# Altium project Q24_Steering_Wheel.PrjPcb
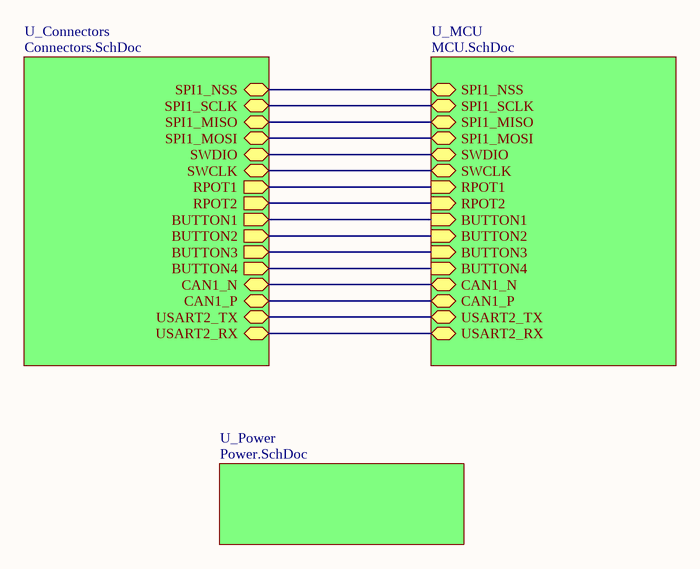
[diagram p0: Top.SchDoc]
5 sheets, 64 parts. Net scope: hierarchical (ports join the sheet entries above them; power ports are global).
Board file: Q24_Steering_Wheel.PcbDoc
Sheets:
  Top.SchDoc
    U_MCU = MCU.SchDoc
      U_CAN = CAN.SchDoc
    U_Connectors = Connectors.SchDoc
    U_Power = Power.SchDoc

## Sheet Top.SchDoc
size A4; SheetNumber: 1; SheetTotal: 5

### Sub-sheets
U_Connectors = Connectors.SchDoc: BUTTON1 (out), BUTTON3 (out), BUTTON4 (out), BUTTON2 (out), USART2_RX (bidir), USART2_TX (bidir), RPOT1 (out), RPOT2 (out), SPI1_MOSI (bidir), SPI1_MISO (bidir), SPI1_SCLK (bidir), SPI1_NSS (bidir), SWDIO (bidir), SWCLK (bidir), CAN1_P (bidir), CAN1_N (bidir)
U_MCU = MCU.SchDoc: USART2_RX (bidir), SPI1_NSS (bidir), SPI1_SCLK (bidir), SPI1_MISO (bidir), SPI1_MOSI (bidir), SWDIO (bidir), SWCLK (bidir), RPOT1 (in), RPOT2 (in), BUTTON3 (in), BUTTON4 (in), BUTTON2 (in), BUTTON1 (in), CAN1_N (bidir), CAN1_P (bidir), USART2_TX (bidir)
U_Power = Power.SchDoc: no entries

### Nets
BUTTON1: sheet U_MCU/BUTTON1, sheet U_Connectors/BUTTON1
BUTTON2: sheet U_MCU/BUTTON2, sheet U_Connectors/BUTTON2
BUTTON3: sheet U_MCU/BUTTON3, sheet U_Connectors/BUTTON3
BUTTON4: sheet U_MCU/BUTTON4, sheet U_Connectors/BUTTON4
CAN1_N: sheet U_MCU/CAN1_N, sheet U_Connectors/CAN1_N
CAN1_P: sheet U_MCU/CAN1_P, sheet U_Connectors/CAN1_P
RPOT1: sheet U_MCU/RPOT1, sheet U_Connectors/RPOT1
RPOT2: sheet U_MCU/RPOT2, sheet U_Connectors/RPOT2
NetIC1_16: sheet U_MCU/USART2_TX, sheet U_Connectors/USART2_TX
NetIC1_17: sheet U_MCU/USART2_RX, sheet U_Connectors/USART2_RX
NetIC1_20: sheet U_MCU/SPI1_NSS, sheet U_Connectors/SPI1_NSS
NetIC1_21: sheet U_MCU/SPI1_SCLK, sheet U_Connectors/SPI1_SCLK
NetIC1_22: sheet U_MCU/SPI1_MISO, sheet U_Connectors/SPI1_MISO
NetIC1_23: sheet U_MCU/SPI1_MOSI, sheet U_Connectors/SPI1_MOSI
NetIC1_46: sheet U_MCU/SWDIO, sheet U_Connectors/SWDIO
NetIC1_49: sheet U_MCU/SWCLK, sheet U_Connectors/SWCLK

## Sheet MCU.SchDoc
size 381 x 241 mm; SheetNumber: 4; SheetTotal: 5
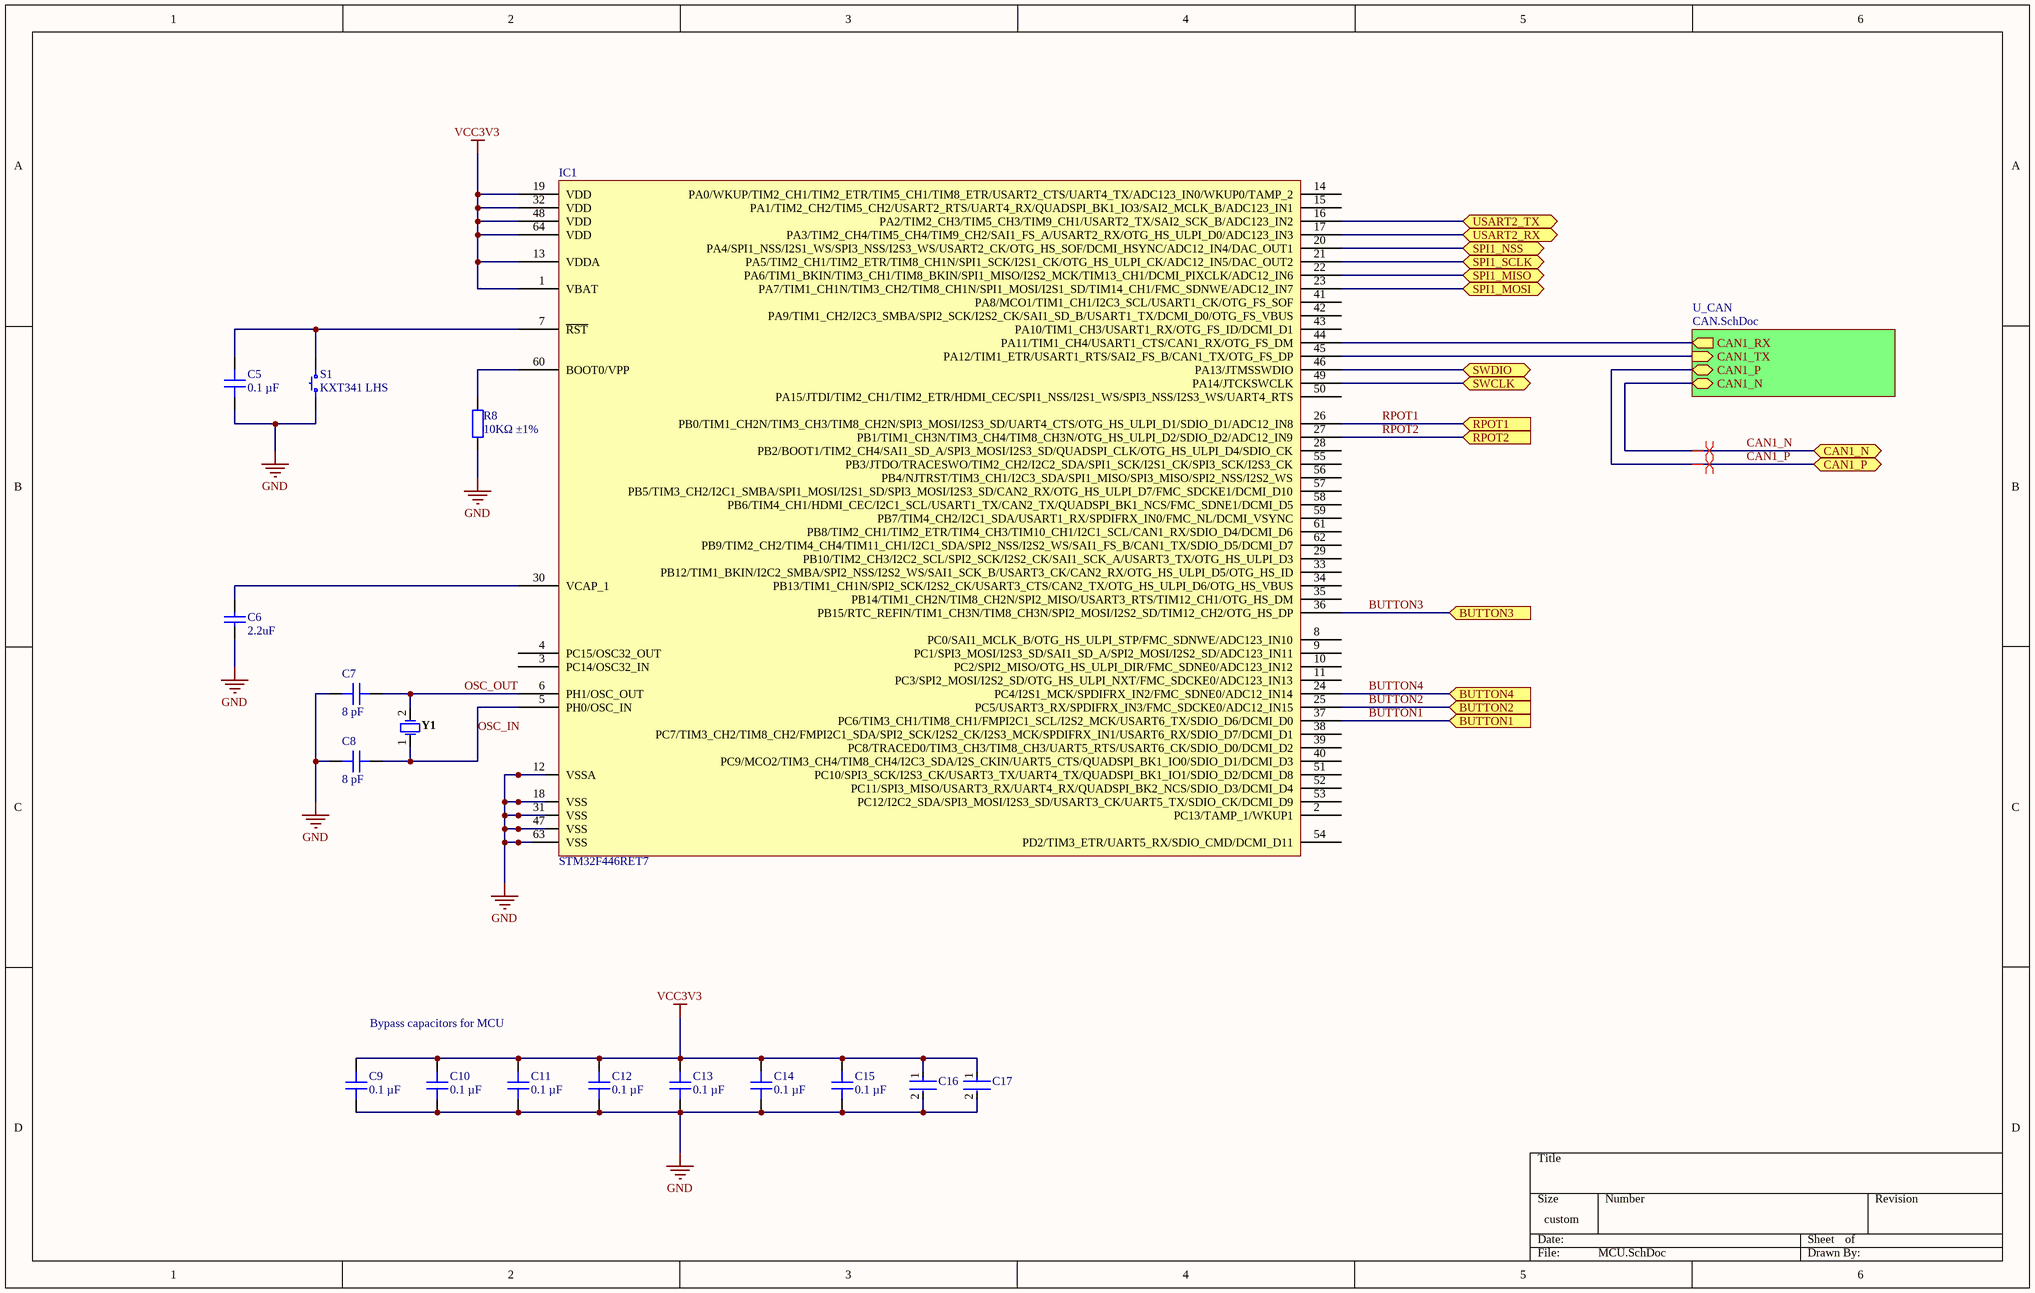
[diagram p1: MCU.SchDoc]

### Parts
C5  0.1 µF  [CAP 0402_1005]
C6  2.2uF  [0603_C]
C7  8 pF  [CAP 0402_1005]
C8  8 pF  [CAP 0402_1005]
C9  0.1 µF  [CAP 0402_1005]
C10  0.1 µF  [CAP 0402_1005]
C11  0.1 µF  [CAP 0402_1005]
C12  0.1 µF  [CAP 0402_1005]
C13  0.1 µF  [CAP 0402_1005]
C14  0.1 µF  [CAP 0402_1005]
C15  0.1 µF  [CAP 0402_1005]
C16  CGB2A1X5R1A105K033BC  [FP-CGB2A-IPC_B]  (value not drawn)
C17  CGB2A1X5R1A105K033BC  [FP-CGB2A-IPC_B]  (value not drawn)
IC1  STM32F446RET7  [ST LQFP-64 10X10MM]
R8  10KΩ ±1%  [0402_R]
S1  KXT341 LHS  [C&K KXT3]
Y1  NX3225GD-8MHZ-STD-CRA-3  [NDK-NX3225GD-8MHZ-STD-CRA-3_V]  (value not drawn)

### Sub-sheets
U_CAN = CAN.SchDoc: CAN1_TX (in), CAN1_RX (out), CAN1_P (bidir), CAN1_N (bidir)

### Ports
BUTTON1 (in, see Top[3B], Connectors[1B]), BUTTON2 (in, see Top[3B], Connectors[2B]), BUTTON3 (in, see Top[3B], Connectors[1C]), BUTTON4 (in, see Top[3B], Connectors[2C]), CAN1_N (bidir, see Top[3B], CAN[3B], Connectors[2D]), CAN1_P (bidir, see Top[3B], CAN[3B], Connectors[2D]), RPOT1 (in, see Top[3B], Connectors[3A]), RPOT2 (in, see Top[3B], Connectors[4A]), SPI1_MISO (bidir, see Top[3B], Connectors[3C]), SPI1_MOSI (bidir, see Top[3B], Connectors[3C]), SPI1_NSS (bidir, see Top[3A], Connectors[3C]), SPI1_SCLK (bidir, see Top[3B], Connectors[3C]), SWCLK (bidir, see Top[3B], Connectors[3B]), SWDIO (bidir, see Top[3B], Connectors[3B]), USART2_RX (bidir, see Top[3B], Connectors[3B]), USART2_TX (bidir, see Top[3B], Connectors[3C])

### Nets
GND: C5.1 C6.1 C7.2 C8.2 C9.1 C10.1 C11.1 C12.1 C13.1 C14.1 C15.1 C16.2 C17.2 IC1.12(VSSA) IC1.18(VSS) IC1.31(VSS) IC1.47(VSS) IC1.63(VSS) R8.1 S1.1
VCC3V3: C9.2 C10.2 C11.2 C12.2 C13.2 C14.2 C15.2 C16.1 C17.1 IC1.1(VBAT) IC1.13(VDDA) IC1.19(VDD) IC1.32(VDD) IC1.48(VDD) IC1.64(VDD)
BUTTON1: IC1.37(PC6/TIM3_CH1/TIM8_CH1/FMPI2C1_SCL/I2S2_MCK/USART6_TX/SDIO_D6/DCMI_D0) ; port BUTTON1
BUTTON2: IC1.25(PC5/USART3_RX/SPDIFRX_IN3/FMC_SDCKE0/ADC12_IN15) ; port BUTTON2
BUTTON3: IC1.36(PB15/RTC_REFIN/TIM1_CH3N/TIM8_CH3N/SPI2_MOSI/I2S2_SD/TIM12_CH2/OTG_HS_DP) ; port BUTTON3
BUTTON4: IC1.24(PC4/I2S1_MCK/SPDIFRX_IN2/FMC_SDNE0/ADC12_IN14) ; port BUTTON4
CAN1_N: port CAN1_N, sheet U_CAN/CAN1_N
CAN1_P: port CAN1_P, sheet U_CAN/CAN1_P
OSC_IN: C8.1 IC1.5(PH0/OSC_IN) Y1.1
OSC_OUT: C7.1 IC1.6(PH1/OSC_OUT) Y1.2
RPOT1: IC1.26(PB0/TIM1_CH2N/TIM3_CH3/TIM8_CH2N/SPI3_MOSI/I2S3_SD/UART4_CTS/OTG_HS_ULPI_D1/SDIO_D1/ADC12_IN8) ; port RPOT1
RPOT2: IC1.27(PB1/TIM1_CH3N/TIM3_CH4/TIM8_CH3N/OTG_HS_ULPI_D2/SDIO_D2/ADC12_IN9) ; port RPOT2
NetC5_2: C5.2 IC1.7(~{RST}) S1.2
NetC6_2: C6.2 IC1.30(VCAP_1)
NetIC1_16: IC1.16(PA2/TIM2_CH3/TIM5_CH3/TIM9_CH1/USART2_TX/SAI2_SCK_B/ADC123_IN2) ; port USART2_TX
NetIC1_17: IC1.17(PA3/TIM2_CH4/TIM5_CH4/TIM9_CH2/SAI1_FS_A/USART2_RX/OTG_HS_ULPI_D0/ADC123_IN3) ; port USART2_RX
NetIC1_20: IC1.20(PA4/SPI1_NSS/I2S1_WS/SPI3_NSS/I2S3_WS/USART2_CK/OTG_HS_SOF/DCMI_HSYNC/ADC12_IN4/DAC_OUT1) ; port SPI1_NSS
NetIC1_21: IC1.21(PA5/TIM2_CH1/TIM2_ETR/TIM8_CH1N/SPI1_SCK/I2S1_CK/OTG_HS_ULPI_CK/ADC12_IN5/DAC_OUT2) ; port SPI1_SCLK
NetIC1_22: IC1.22(PA6/TIM1_BKIN/TIM3_CH1/TIM8_BKIN/SPI1_MISO/I2S2_MCK/TIM13_CH1/DCMI_PIXCLK/ADC12_IN6) ; port SPI1_MISO
NetIC1_23: IC1.23(PA7/TIM1_CH1N/TIM3_CH2/TIM8_CH1N/SPI1_MOSI/I2S1_SD/TIM14_CH1/FMC_SDNWE/ADC12_IN7) ; port SPI1_MOSI
NetIC1_44: IC1.44(PA11/TIM1_CH4/USART1_CTS/CAN1_RX/OTG_FS_DM) ; sheet U_CAN/CAN1_RX
NetIC1_45: IC1.45(PA12/TIM1_ETR/USART1_RTS/SAI2_FS_B/CAN1_TX/OTG_FS_DP) ; sheet U_CAN/CAN1_TX
NetIC1_46: IC1.46(PA13/JTMSSWDIO) ; port SWDIO
NetIC1_49: IC1.49(PA14/JTCKSWCLK) ; port SWCLK
NetIC1_60: IC1.60(BOOT0/VPP) R8.2

Not connected (* = marked no-connect by the designer): IC1 2(PC13/TAMP_1/WKUP1) 3(PC14/OSC32_IN) 4(PC15/OSC32_OUT) 8(PC0/SAI1_MCLK_B/OTG_HS_ULPI_STP/FMC_SDNWE/ADC123_IN10) 9(PC1/SPI3_MOSI/I2S3_SD/SAI1_SD_A/SPI2_MOSI/I2S2_SD/ADC123_IN11) 10(PC2/SPI2_MISO/OTG_HS_ULPI_DIR/FMC_SDNE0/ADC123_IN12) 11(PC3/SPI2_MOSI/I2S2_SD/OTG_HS_ULPI_NXT/FMC_SDCKE0/ADC123_IN13) 14(PA0/WKUP/TIM2_CH1/TIM2_ETR/TIM5_CH1/TIM8_ETR/USART2_CTS/UART4_TX/ADC123_IN0/WKUP0/TAMP_2) 15(PA1/TIM2_CH2/TIM5_CH2/USART2_RTS/UART4_RX/QUADSPI_BK1_IO3/SAI2_MCLK_B/ADC123_IN1) 28(PB2/BOOT1/TIM2_CH4/SAI1_SD_A/SPI3_MOSI/I2S3_SD/QUADSPI_CLK/OTG_HS_ULPI_D4/SDIO_CK) 29(PB10/TIM2_CH3/I2C2_SCL/SPI2_SCK/I2S2_CK/SAI1_SCK_A/USART3_TX/OTG_HS_ULPI_D3) 33(PB12/TIM1_BKIN/I2C2_SMBA/SPI2_NSS/I2S2_WS/SAI1_SCK_B/USART3_CK/CAN2_RX/OTG_HS_ULPI_D5/OTG_HS_ID) 34(PB13/TIM1_CH1N/SPI2_SCK/I2S2_CK/USART3_CTS/CAN2_TX/OTG_HS_ULPI_D6/OTG_HS_VBUS) 35(PB14/TIM1_CH2N/TIM8_CH2N/SPI2_MISO/USART3_RTS/TIM12_CH1/OTG_HS_DM) 38(PC7/TIM3_CH2/TIM8_CH2/FMPI2C1_SDA/SPI2_SCK/I2S2_CK/I2S3_MCK/SPDIFRX_IN1/USART6_RX/SDIO_D7/DCMI_D1) 39(PC8/TRACED0/TIM3_CH3/TIM8_CH3/UART5_RTS/USART6_CK/SDIO_D0/DCMI_D2) 40(PC9/MCO2/TIM3_CH4/TIM8_CH4/I2C3_SDA/I2S_CKIN/UART5_CTS/QUADSPI_BK1_IO0/SDIO_D1/DCMI_D3) 41(PA8/MCO1/TIM1_CH1/I2C3_SCL/USART1_CK/OTG_FS_SOF) 42(PA9/TIM1_CH2/I2C3_SMBA/SPI2_SCK/I2S2_CK/SAI1_SD_B/USART1_TX/DCMI_D0/OTG_FS_VBUS) 43(PA10/TIM1_CH3/USART1_RX/OTG_FS_ID/DCMI_D1) 50(PA15/JTDI/TIM2_CH1/TIM2_ETR/HDMI_CEC/SPI1_NSS/I2S1_WS/SPI3_NSS/I2S3_WS/UART4_RTS) 51(PC10/SPI3_SCK/I2S3_CK/USART3_TX/UART4_TX/QUADSPI_BK1_IO1/SDIO_D2/DCMI_D8) 52(PC11/SPI3_MISO/USART3_RX/UART4_RX/QUADSPI_BK2_NCS/SDIO_D3/DCMI_D4) 53(PC12/I2C2_SDA/SPI3_MOSI/I2S3_SD/USART3_CK/UART5_TX/SDIO_CK/DCMI_D9) 54(PD2/TIM3_ETR/UART5_RX/SDIO_CMD/DCMI_D11) 55(PB3/JTDO/TRACESWO/TIM2_CH2/I2C2_SDA/SPI1_SCK/I2S1_CK/SPI3_SCK/I2S3_CK) 56(PB4/NJTRST/TIM3_CH1/I2C3_SDA/SPI1_MISO/SPI3_MISO/SPI2_NSS/I2S2_WS) 57(PB5/TIM3_CH2/I2C1_SMBA/SPI1_MOSI/I2S1_SD/SPI3_MOSI/I2S3_SD/CAN2_RX/OTG_HS_ULPI_D7/FMC_SDCKE1/DCMI_D10) 58(PB6/TIM4_CH1/HDMI_CEC/I2C1_SCL/USART1_TX/CAN2_TX/QUADSPI_BK1_NCS/FMC_SDNE1/DCMI_D5) 59(PB7/TIM4_CH2/I2C1_SDA/USART1_RX/SPDIFRX_IN0/FMC_NL/DCMI_VSYNC) 61(PB8/TIM2_CH1/TIM2_ETR/TIM4_CH3/TIM10_CH1/I2C1_SCL/CAN1_RX/SDIO_D4/DCMI_D6) 62(PB9/TIM2_CH2/TIM4_CH4/TIM11_CH1/I2C1_SDA/SPI2_NSS/I2S2_WS/SAI1_FS_B/CAN1_TX/SDIO_D5/DCMI_D7)

### Layout directives
differential pair: CAN1_N, CAN1_P

### Notes on the sheet
- Bypass capacitors for MCU

### Library data of the parts
C5 C9-C15 = C0402C104K4RECAUTO: CAP CER 0402 0.1UF 16V X7R 10%; manufacturer: KEMET; Part Number: C0402C104K4RECAUTO; Value: 0.1 µF; Applications: Automotive, ESD Protection; Capacitance: 0.1 µF; componentlink1description: Datasheet; componentlink1url: https://api.kemet.com/component-edge/download/datasheet/C0402C104K4RECAUTO.pdf; componentlink2description: DigiKey Link; componentlink2url: https://www.digikey.com/en/products/detail/kemet/C0402C104K4RECAUTO/8563695; Device Package: 0402 (1005 Metric); lastupdated: 2023-09-26 7:04:17 PM; Lifecycle Status: Active; Minimum Order: 1; Mounting Type: Surface Mount, MLCC; Operating Temperature: -55°C ~ 125°C; Package / Case: 0402 (1005 Metric); packaging: TapeAndReel; partid: 1731; Part Status: Active; price: 0.01; Ratings: AEC-Q200; series: ESD SMD Auto X7R; Size / Dimension: 0.039" L x 0.020" W (1.00mm x 0.50mm); Supplier 1: DigiKey; Supplier Part Number 1: 399-17167-1-ND; Temperature Coefficient: X7R; Thickness (Max): 0.022" (0.55mm); Tolerance: ±10%; Voltage - Rated: 16V
C6 = 0603 2.2uF (225) 10% 16V: Chip capacitors; Manufacturer: Samsung Electro-Mechanics; PartNumber: CL10A225KO8NNNC; Tolerance: 10%; Voltage: 16V; ComponentLink1Description: Supplier link; ComponentLink1URL: http://www.szlcsc.com/product/details_24366.html; Package: 0603; Supplier: LC; SuppliersPartNumber: C23630; Capacitance: 2.2uF
C7 C8 = C1005NP01H080D050BA: CAP CER 8PF 50V NP0 0402; manufacturer: TDK Corporation; Temperature Coefficient: C0G, NP0; Tolerance: ±0.5pF; Part Number: C1005NP01H080D050BA; Value: 8 pF; Applications: General Purpose; Capacitance: 8 pF; componentlink1description: Datasheet; componentlink1url: https://product.tdk.com/info/en/catalog/datasheets/mlcc_commercial_hightemp_en.pdf?ref_disty=digikey; componentlink2description: DigiKey Link; componentlink2url: https://www.digikey.com/en/products/detail/tdk-corporation/C1005NP01H080D050BA/3951017; Device Package: 0402 (1005 Metric); Features: High Temperature; lastupdated: 2023-09-26 7:04:16 PM; Lifecycle Status: Active; Minimum Order: 1; Mounting Type: Surface Mount, MLCC; Operating Temperature: -55°C ~ 150°C; Package / Case: 0402 (1005 Metric); packaging: TapeAndReel; partid: 2033; Part Status: Active; price: 0.01; series: C; Size / Dimension: 0.039" L x 0.020" W (1.00mm x 0.50mm); Supplier 1: DigiKey; Supplier Part Number 1: 445-13781-1-ND; Thickness (Max): 0.022" (0.55mm); Voltage - Rated: 50V
C16 C17 = CMP-08246-005807-1: Multilayer Ceramic Capacitors 1uF ±10% 10V X5R SMD 0402; Length: 0.039inch; Width: 0.02inch; Capacitance: 1uF; Case Code (Imperial): 0402; RoHS Compliant: Yes; Min Operating Temperature: -55°C; Case/Package: 0402; Thickness: 0.013inch; Series: CGB; Max Operating Temperature: 85°C; Mount: Surface Mount; Case Code (Metric): 1005; Lead Free: Lead Free; Tolerance: 10%; Package Quantity: 10000; Voltage Rating: 10V; Packaging: Tape and Reel
IC1 = STM32F446RET7: IC MCU 32BIT 512KB FLASH 64LQFP; Manufacturer: STMicroelectronics; Connectivity: CANbus, EBI/EMI, I²C, IrDA, LINbus, SAI, SD, SPDIF-Rx, SPI, UART/USART, USB, USB OTG; Core Processor: ARM® Cortex®-M4; Core Size: 32-Bit Single-Core; Data Converters: A/D 16x12b; D/A 2x12b; Number of I/O: 50; Oscillator Type: Internal; Peripherals: Brown-out Detect/Reset, DMA, I²S, LVD, POR, PWM, WDT; Program Memory Size: 512KB (512K x 8); RAM Size: 128K x 8; Speed: 180MHz; Voltage - Supply (Vcc/Vdd): 1.7V ~ 3.6V; Part Number: STM32F446RET7; ComponentLink1Description: Datasheet; ComponentLink1URL: https://www.st.com/content/ccc/resource/technical/document/datasheet/65/cb/75/50/53/d6/48/24/DM00141306.pdf/files/DM00141306.pdf/jcr:content/translations/en.DM00141306.pdf; ComponentLink2Description: DigiKey Link; ComponentLink2URL: https://www.digikey.com/en/products/detail/stmicroelectronics/STM32F446RET7/6207480; LastUpdated: 2023-07-12 8:21:53 PM; Lifecycle Status: Active; Minimum Order: 1; Mounting Type: Surface Mount; Operating Temperature: -40°C ~ 105°C (TA); Packaging: Tray; PartId: 220; Part Status: Active; Price: 7.43; Program Memory Type: FLASH; Series: STM32F4; Supplier 1: DigiKey; Supplier Part Number 1: 497-16775-ND; Supplier Device Package: 64-LQFP (10x10)
R8 = 0402 10K (1002) 1%: Chip resistor; Manufacturer: Uniroyal Elec; PartNumber: 0402WGF1002TCE; Power: 1/16W; ComponentLink1Description: Supplier link; ComponentLink1URL: http://www.szlcsc.com/product/details_26487.html; Package: 0402; Supplier: LC; SuppliersPartNumber: C25744; Resistance: 10KΩ; Tolerance: 1%
S1 = KXT341 LHS: SWITCH TACTILE SPST-NO 0.02A 15V; Manufacturer: C&K; Actuator Height off PCB, Vertical: 0.60mm; Actuator Orientation: Top Actuated; Actuator Type: Standard; Contact Rating @ Voltage: 0.02A @ 15VDC; Illumination: Non-Illuminated; Operating Force: 330gf; Outline: 3.00mm x 2.00mm; Switch Function: Off-Mom; Part Number: KXT341 LHS; Circuit: SPST-NO; ComponentLink1Description: Datasheet; ComponentLink1URL: https://dznh3ojzb2azq.cloudfront.net/products/Tactile/KXT3/documents/datasheet.pdf; ComponentLink2Description: DigiKey Link; ComponentLink2URL: https://www.digikey.com/en/products/detail/c-k/KXT341-LHS/6607322; LastUpdated: 2023-09-26 8:43:27 PM; Lifecycle Status: Active; Minimum Order: 1; Mounting Type: Surface Mount; Operating Temperature: -40°C ~ 85°C; Packaging: TapeAndReel; Part Status: Active; Price: 0.13; Series: KXT3; Supplier 1: DigiKey; Supplier Part Number 1: CKN10781CT-ND; Termination Style: SMD (SMT) Tab
Y1 = CMP-2000-07595-1: Crystal Unit, 8 MHz, 8 pF, -40 to 150 degC, 2-Pin SMD, RoHS, Tape and Reel; Manufacturer: NDK; Load Capacitance: 8pF; ESR (Equivalent Series Resistance): 500Ohm; Frequency Tolerance: 50ppm; Frequency Stability: 150ppm; Frequency: 8MHz; Case/Package: SMD/SMT; Datasheet Version: 11/2016; Min Operating Temperature: -40degC; Packaging: TapeandReel; Width: 0.098inch; Package Quantity: 3000; Number of Pins: 2; Package Description: 2-Pin Surface Mount Device, Body 3.2 x 2.5 mm; RoHSCompliant: True; Package Reference: NX3225GD-8MHZ-STD-CRA-3; Datasheet URL: http://www.ndk.com/images/products/catalog/c_NX3225GD-STD-CRA-3_e.pdf; Mounting Technology: SurfaceMount; Length: 0.126inch; Mount: SurfaceMount; Manufacturer URL: http://www.ndk.com/en/; Max Operating Temperature: 150degC; Height: 0.039inch

## Sheet CAN.SchDoc
size A4; SheetNumber: 5; SheetTotal: 5
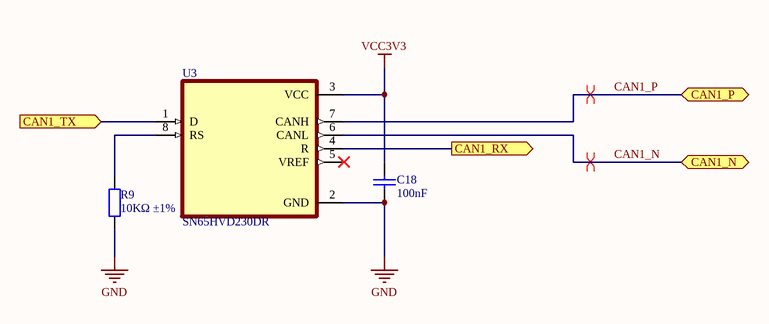
[diagram p2: CAN.SchDoc]

### Parts
C18  100nF  [0402_C]
R9  10KΩ ±1%  [0402_R]
U3  SN65HVD230DR  [SOIC127P599X175-8N]

### Ports
CAN1_N (bidir, see MCU[6B], Connectors[2D], MCU[6B]), CAN1_P (bidir, see MCU[6B], Connectors[2D], MCU[6B]), CAN1_RX (out, see MCU[6B]), CAN1_TX (in, see MCU[6B])

### Nets
GND: C18.2 R9.1 U3.2(GND)
VCC3V3: C18.1 U3.3(VCC)
CAN1_N: U3.6(CANL) ; port CAN1_N
CAN1_P: U3.7(CANH) ; port CAN1_P
NetIC1_44: U3.4(R) ; port CAN1_RX
NetIC1_45: U3.1(D) ; port CAN1_TX
NetR9_2: R9.2 U3.8(RS)

Not connected (* = marked no-connect by the designer): U3 5(VREF)*

### Layout directives
differential pair: CAN1_N, CAN1_P

### Library data of the parts
C18 = 0402 100nF (104) 10% 16V: Chip capacitors; Manufacturer: Samsung Electro-Mechanics; PartNumber: CL05B104KO5NNNC; Tolerance: 10%; Voltage: 16V; ComponentLink1Description: Supplier link; ComponentLink1URL: http://www.szlcsc.com/product/details_1877.html; Package: 0402; Supplier: LC; SuppliersPartNumber: C1525; Capacitance: 100nF
R9 = 0402 10K (1002) 1%: as R8 on sheet MCU; ComponentLink1Description: Supplier link; ComponentLink1URL: http://www.szlcsc.com/product/details_26487.html; Package: 0402; Supplier: LC; SuppliersPartNumber: C25744; Resistance: 10KΩ; Tolerance: 1%
U3 = SN65HVD230DR: 3.3 V CAN Transceiver with Standby Mode; MF: Texas Instruments; Availability: In Stock; SnapEDA_Link: https://www.snapeda.com/parts/SN65HVD230DR/Texas+Instruments/view-part/?ref=snap; Price: None; Check_prices: https://www.snapeda.com/parts/SN65HVD230DR/Texas+Instruments/view-part/?ref=eda; Package: SOIC-8 Texas Instruments; MP: SN65HVD230DR; Value: *; Purchase-URL: https://pricing.snapeda.com/search/part/SN65HVD230DR/?ref=eda

## Sheet Connectors.SchDoc
size A4; SheetNumber: 3; SheetTotal: 5
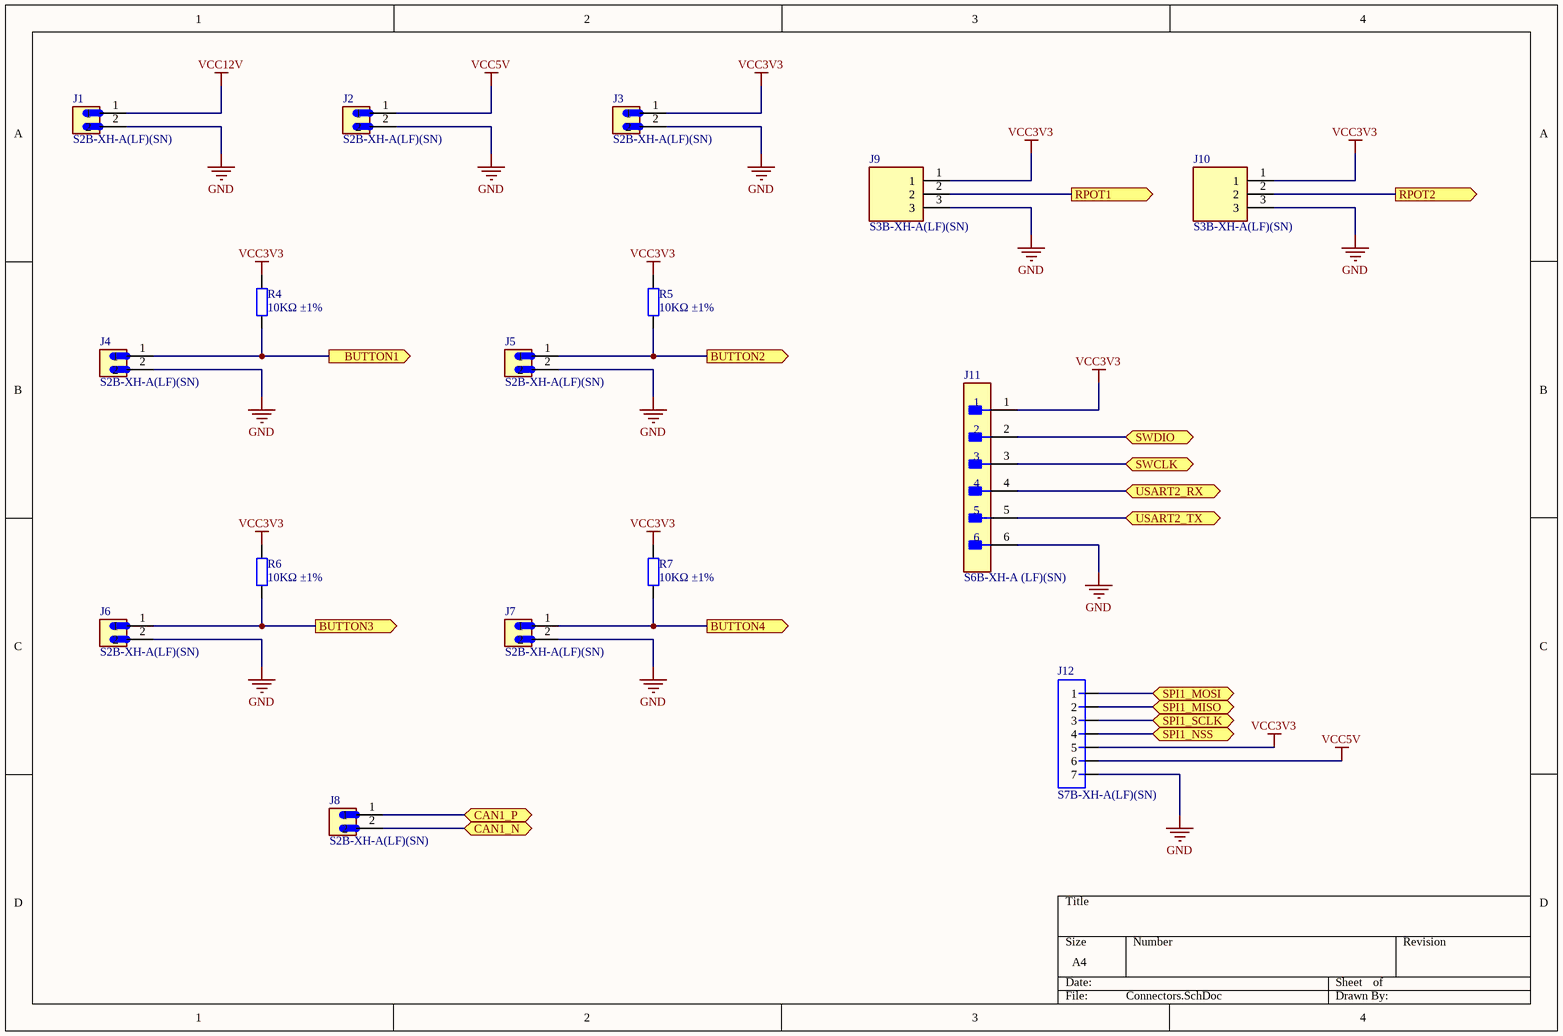
[diagram p3: Connectors.SchDoc]

### Parts
J1  S2B-XH-A(LF)(SN)  [JST_S2B-XH-A(LF)(SN)]
J2  S2B-XH-A(LF)(SN)  [JST_S2B-XH-A(LF)(SN)]
J3  S2B-XH-A(LF)(SN)  [JST_S2B-XH-A(LF)(SN)]
J4  S2B-XH-A(LF)(SN)  [JST_S2B-XH-A(LF)(SN)]
J5  S2B-XH-A(LF)(SN)  [JST_S2B-XH-A(LF)(SN)]
J6  S2B-XH-A(LF)(SN)  [JST_S2B-XH-A(LF)(SN)]
J7  S2B-XH-A(LF)(SN)  [JST_S2B-XH-A(LF)(SN)]
J8  S2B-XH-A(LF)(SN)  [JST_S2B-XH-A(LF)(SN)]
J9  S3B-XH-A(LF)(SN)  [JST_S3B-XH-A(LF)(SN)]
J10  S3B-XH-A(LF)(SN)  [JST_S3B-XH-A(LF)(SN)]
J11  S6B-XH-A (LF)(SN)  [FP-S6B-XH-A_LF_SN-MFG]
J12  S7B-XH-A(LF)(SN)  [JST_S7B-XH-A(LF)(SN)]
R4  10KΩ ±1%  [0402_R]
R5  10KΩ ±1%  [0402_R]
R6  10KΩ ±1%  [0402_R]
R7  10KΩ ±1%  [0402_R]

### Ports
BUTTON1 (out, see Top[2B], MCU[5C]), BUTTON2 (out, see Top[2B], MCU[5C]), BUTTON3 (out, see Top[2B], MCU[5B]), BUTTON4 (out, see Top[2B], MCU[5C]), CAN1_N (bidir, see Top[2B], CAN[3B], MCU[6B]), CAN1_P (bidir, see Top[2B], CAN[3B], MCU[6B]), RPOT1 (out, see Top[2B], MCU[5B]), RPOT2 (out, see Top[2B], MCU[5B]), SPI1_MISO (bidir, see Top[2B], MCU[5A]), SPI1_MOSI (bidir, see Top[2B], MCU[5A]), SPI1_NSS (bidir, see Top[2A], MCU[5A]), SPI1_SCLK (bidir, see Top[2B], MCU[5A]), SWCLK (bidir, see Top[2B], MCU[5B]), SWDIO (bidir, see Top[2B], MCU[5B]), USART2_RX (bidir, see Top[2B], MCU[5A]), USART2_TX (bidir, see Top[2B], MCU[5A])

### Nets
GND: J1.2 J2.2 J3.2 J4.2 J5.2 J6.2 J7.2 J9.3 J10.3 J11.6 J12.7
VCC3V3: J3.1 J9.1 J10.1 J11.1 J12.5 R4.2 R5.2 R6.2 R7.2
VCC5V: J2.1 J12.6
VCC12V: J1.1
BUTTON1: J4.1 R4.1 ; port BUTTON1
BUTTON2: J5.1 R5.1 ; port BUTTON2
BUTTON3: J6.1 R6.1 ; port BUTTON3
BUTTON4: J7.1 R7.1 ; port BUTTON4
CAN1_N: J8.2 ; port CAN1_N
CAN1_P: J8.1 ; port CAN1_P
RPOT1: J9.2 ; port RPOT1
RPOT2: J10.2 ; port RPOT2
NetIC1_16: J11.5 ; port USART2_TX
NetIC1_17: J11.4 ; port USART2_RX
NetIC1_20: J12.4 ; port SPI1_NSS
NetIC1_21: J12.3 ; port SPI1_SCLK
NetIC1_22: J12.2 ; port SPI1_MISO
NetIC1_23: J12.1 ; port SPI1_MOSI
NetIC1_46: J11.2 ; port SWDIO
NetIC1_49: J11.3 ; port SWCLK

### Library data of the parts
J1-J8 = S2B-XH-A(LF)(SN): Connector Header Through Hole, Right Angle 2 position 0.098 (2.50mm); MF: JST Sales; Purchase-URL: https://pricing.snapeda.com/search/part/S2B-XH-A(LF)(SN)/?ref=eda; Digi-Key_Part_Number: 455-2257-ND; Package: None; Check_prices: https://www.snapeda.com/parts/S2B-XH-A(LF)(SN)/JST+Sales+America+Inc./view-part/?ref=eda; Value: *; SnapEDA_Link: https://www.snapeda.com/parts/S2B-XH-A(LF)(SN)/JST+Sales+America+Inc./view-part/?ref=snap; MP: S2B-XH-A(LF)(SN)
J9 J10 = S3B-XH-A(LF)(SN): CONN, R/A HEADER, 3POS, 1ROW, 2.5MM; Connector Systems:Wire-to-Board; Pitch Spacing:2.5mm; No. of Rows:1Rows; No. of Contacts:3Contacts; Contact Termination Type:Through Hole Right Angle; Product Range:XH Series RoHS Compliant: Yes; MF: JST; Purchase-URL: https://pricing.snapeda.com/search/part/S3B-XH-A (LF)(SN)/?ref=eda; Check_prices: https://www.snapeda.com/parts/S3B-XH-A%20(LF)(SN)/JST/view-part/?ref=eda; SnapEDA_Link: https://www.snapeda.com/parts/S3B-XH-A%20(LF)(SN)/JST/view-part/?ref=snap; Price: None; Availability: In Stock; Package: None; MP: S3B-XH-A (LF)(SN); Value: *
J11 = CMP-17439-000165-2: CONN HEADER R/A 6POS 2.5MM; Number of Contacts: 6; Contact Resistance: 20mR; Max Current Rating: 3A; Max Voltage Rating (AC): 250V; Gender: Male; Insulation Resistance: 1GR; Wire/Cable Gauge: 22AWG; Fastening Type: Detent; Lead Pitch: 2.5mm; Flammability Rating: UL94 V-0; Contact Finish - Mating: TIN; Housing Material: Polyamide; Length: 17.4mm; Termination: Solder; Contact Type: Male Pin; Number of Positions: 6; Mount: Through Hole; Orientation: Right Angle; Voltage Rating (AC): 250V; Contact Shape: Square; Lead Free: Lead Free; Insulation Material: Nylon; Insulation Color: Natural; Contact Plating: Tin; Connector Type: Header; Housing Color: White; Color: Natural; Package Quantity: 500; Contact Material: Brass; Packaging: Bulk; Pitch: 2.5mm; Series: XH; Number of Rows: 1; Min Operating Temperature: -25°C; Voltage Rating: 250V; REACH SVHC: No SVHC; Current Rating: 3A; Depth: 11.5mm; Max Operating Temperature: 85°C
J12 = S7B-XH-A(LF)(SN): Connector Header Through Hole, Right Angle 7 position 0.098 _2.50mm_; MP: S7B-XH-A_LF__SN_; MF: JST Sales; SnapEDA_Link: https://www.snapeda.com/parts/S7B-XH-A%28LF%29%28SN%29/JST%20Sales%20America%20Inc./view-part/2768211/?ref=snap; Availability: Unavailable; Package: None; Value: *; Price: None
R4-R7 = 0402 10K (1002) 1%: as R8 on sheet MCU; ComponentLink1Description: Supplier link; ComponentLink1URL: http://www.szlcsc.com/product/details_26487.html; Package: 0402; Supplier: LC; SuppliersPartNumber: C25744; Resistance: 10KΩ; Tolerance: 1%

## Sheet Power.SchDoc
size A4; SheetNumber: 2; SheetTotal: 5; SPICEModelCacheCJZDPLED: <root> / <DocumentId>CJZDPLED</DocumentId> / </root>
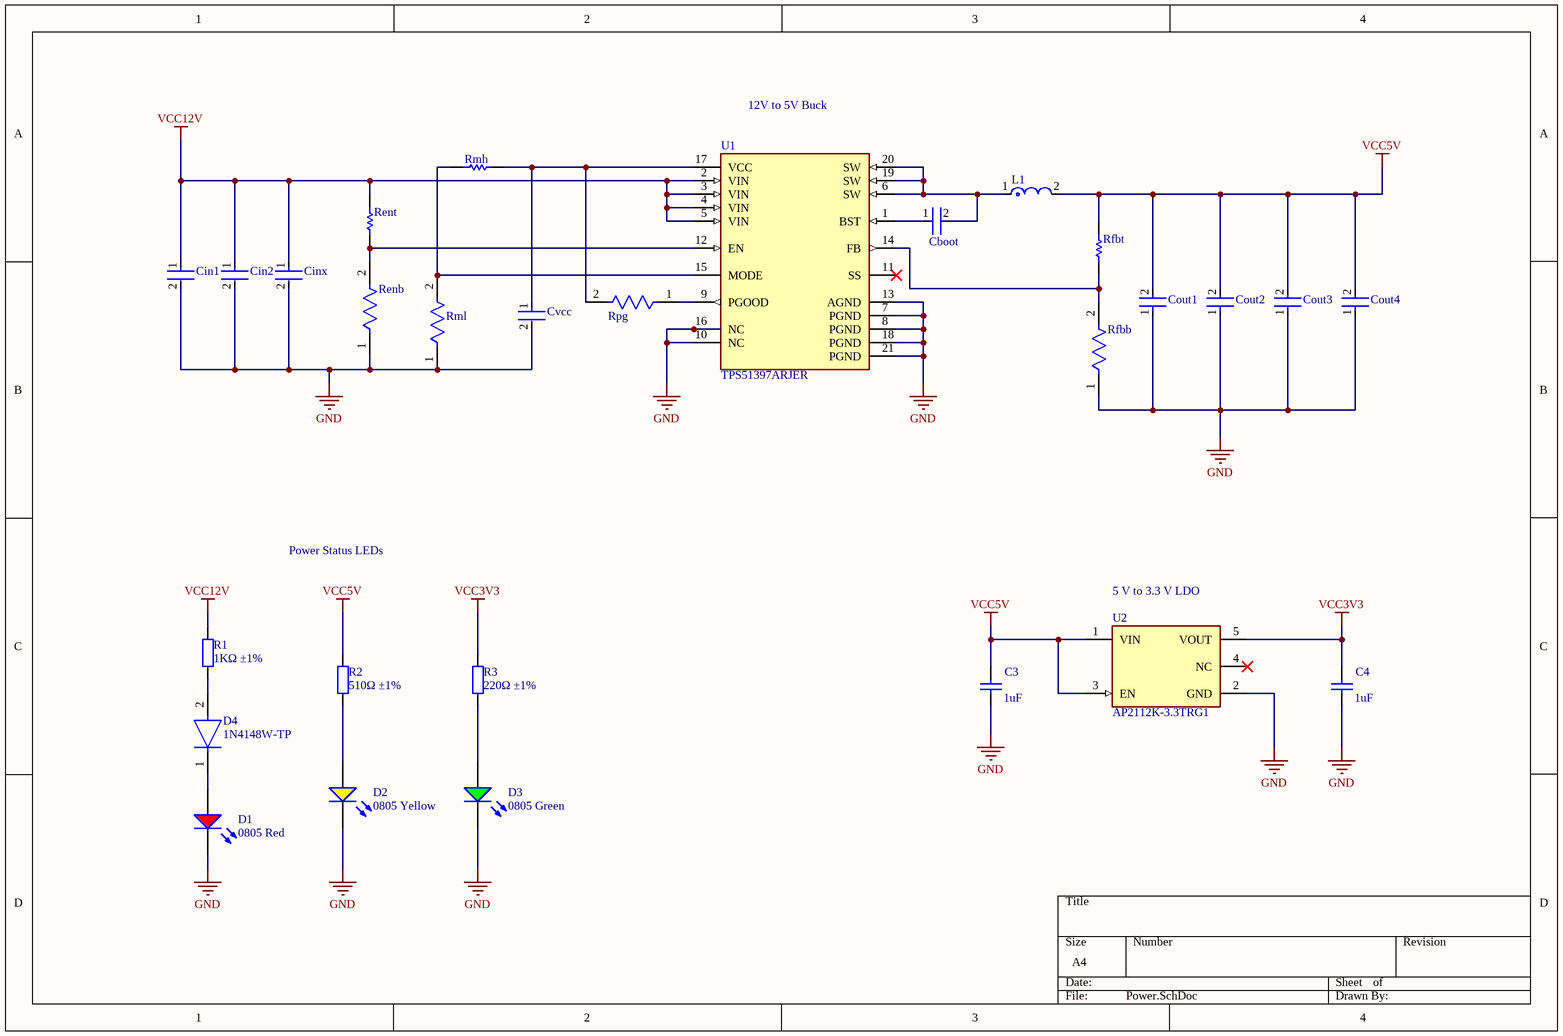
[diagram p4: Power.SchDoc]

### Parts
C3  1uF  [0805_C]
C4  1uF  [0805_C]
Cboot  GRM155R71C104KA88D  [FP-GRM15-MFG]  (value not drawn)
Cin1  C2012X5R1V226M125AC  [FP-C2012-125-0_2-MFG]  (value not drawn)
Cin2  C2012X5R1V226M125AC  [FP-C2012-125-0_2-MFG]  (value not drawn)
Cinx  CGA3E2X7R1H104K080AA  [FP-CGA3E-0_3-0_1-IPC_A]  (value not drawn)
Cout1  GRM31CR61A476KE15K  [FP-GRM31C-0_2-e0_3_0_8-IPC_A]  (value not drawn)
Cout2  GRM31CR61A476KE15K  [FP-GRM31C-0_2-e0_3_0_8-IPC_A]  (value not drawn)
Cout3  GRM31CR61A476KE15K  [FP-GRM31C-0_2-e0_3_0_8-IPC_A]  (value not drawn)
Cout4  GRM31CR61A476KE15K  [FP-GRM31C-0_2-e0_3_0_8-IPC_A]  (value not drawn)
Cvcc  EMK107B7105KA-T  [FP-0603-L_1_6_0_1-W_0_8_0-IPC_C]  (value not drawn)
D1  0805 Red  [0805_LED_S1]
D2  0805 Yellow  [0805_LED_S1]
D3  0805 Green  [0805_LED_S1]
D4  1N4148W-TP  [FP-SOD-123-IPC_A]
L1  XAL7070-182MEC  [FP-XAL7070-MFG]  (value not drawn)
R1  1KΩ ±1%  [0603_R]
R2  510Ω ±1%  [0603_R]
R3  220Ω ±1%  [0603_R]
Renb  CRCW040251K1FKED  [FP-CRCW0402-e3-MFG]  (value not drawn)
Rent  CRCW0402221KFKED  [RESC1005X40X25ML05T05]  (value not drawn)
Rfbb  CRCW040215K0FKED  [FP-CRCW0402-e3-IPC_B]  (value not drawn)
Rfbt  CRCW0402110KFKED  [RESC1005X40X25NL05T05]  (value not drawn)
Rmh  330K 1% 0603(1608)  [RESC0603(1608)_M]  (value not drawn)
Rml  CRCW040215K0FKED  [FP-CRCW0402-e3-IPC_B]  (value not drawn)
Rpg  CRCW0402100KFKEDC  [FP-CRCW0402-C-e3-MFG]  (value not drawn)
U1  TPS51397ARJER  [FP-RJE0020B-MFG]
U2  AP2112K-3.3TRG1  [FP-SOT25-IPC_A]

### Nets
GND: C3.1 C4.1 Cin1.2 Cin2.2 Cinx.2 Cout1.1 Cout2.1 Cout3.1 Cout4.1 Cvcc.2 D1.K D2.K D3.K Renb.1 Rfbb.1 Rml.1 U1.7(PGND) U1.8(PGND) U1.10(NC) U1.13(AGND) U1.16(NC) U1.18(PGND) U1.21(PGND) U2.2(GND)
VCC3V3: C4.2 R3.2 U2.5(VOUT)
VCC5V: C3.2 Cout1.2 Cout2.2 Cout3.2 Cout4.2 L1.2 R2.2 Rfbt.2 U2.1(VIN) U2.3(EN)
VCC12V: Cin1.1 Cin2.1 Cinx.1 R1.2 Rent.2 U1.2(VIN) U1.3(VIN) U1.4(VIN) U1.5(VIN)
NetCboot_1: Cboot.1 U1.1(BST)
NetCboot_2: Cboot.2 L1.1 U1.6(SW) U1.19(SW) U1.20(SW)
NetCvcc_1: Cvcc.1 Rmh.1 Rpg.2 U1.17(VCC)
NetD1_A: D1.A D4.1(C)
NetD2_A: D2.A R2.1
NetD3_A: D3.A R3.1
NetD4_2: D4.2(A) R1.1
NetRenb_2: Renb.2 Rent.1 U1.12(EN)
NetRfbb_2: Rfbb.2 Rfbt.1 U1.14(FB)
NetRmh_2: Rmh.2 Rml.2 U1.15(MODE)
NetRpg_1: Rpg.1 U1.9(PGOOD)

Not connected (* = marked no-connect by the designer): U1 11(SS)*; U2 4(NC)*

### Notes on the sheet
- 12V to 5V Buck
- Power Status LEDs
- (near U2) 5 V to 3.3 V LDO

### Library data of the parts
C3 C4 = 0805 1uF (105) 10% 50V: Chip capacitors; Manufacturer: Samsung Electro-Mechanics; PartNumber: CL21B105KBFNNNE; Tolerance: 10%; Voltage: 50V; ComponentLink1Description: Supplier link; ComponentLink1URL: http://www.szlcsc.com/product/details_29074.html; Package: 0805; Supplier: LC; SuppliersPartNumber: C28323; Capacitance: 1uF
Cboot = CMP-2100-03641-2: CAP CER 0.1UF 16V X7R 0402; Manufacturer: Murata; Standoff Height: 0mm; Tolerance: 10%; Voltage Rating: 16Vdc; Capacitance: 0.10μF; Value: 0.10μF; RoHS: TRUE; Manufacturer Part Number: GRM155R71C104KA88D; Temperature Characteristic: X7R; Octopart: https://octopart.com/grm155r71c104ka88d-murata-196880; Digikey Description: CAP CER 0.1UF 16V X7R 0402; Device Class L3: Ceramic Capacitors; Height: 0.55mm; ComponentLink2Description: Datasheet; Temperature Range Low: -55°C; Ipc Land Pattern Name: CAPC10050X219; ComponentLink2URL: https://search.murata.co.jp/Ceramy/image/img/A01X/G101/ENG/GRM155R71H471KA01-01A.pdf; Device Class L1: Passive Components; Lead Free: yes; Category: Cap; Package: GRM15; Temperature: -55°C to +125°C; Device Class L2: Capacitors; Material: Ceramic; Temperature Range High: +125°C; Mouser Description: 0402 0.1 uF 16V ±10 % Tolerance X7R SMT Multilayer Ceramic Capacitor
Cin1 Cin2 = CMP-2000-06038-3: Multilayer Ceramic Capacitors 22μF ±20% 35V X5R SMD 0805; Capacitance: 22uF; Tolerance: 20%; RoHS Compliant: Yes; Height: 1.25mm; Termination: SMD/SMT; Case/Package: 0805; Thickness: 0.057inch; Max Operating Temperature: 85°C; Min Operating Temperature: -55°C; Voltage Rating (DC): 35V; Length: 0.079inch; Dielectric: X5R; Dielectric Material: Ceramic; Voltage Rating: 35V; Mount: Surface Mount; Package Quantity: 2000; Lead Free: Lead Free; Weight: 0.000194oz; REACH SVHC: No SVHC; Width: 0.049inch; Packaging: Tape and Reel; Series: C; Case Code (Metric): 2012; Case Code (Imperial): 0805
Cinx = CMP-2000-07546-2: Cap Ceramic 100nF 50V X7R 10% Pad SMD 0603 +125°C Automotive T/R; Weight: 7.1E-05oz; Composition: Ceramic; Max Operating Temperature: 125°C; Termination: SMD/SMT; Dielectric: X7R; Length: 1.6mm; Package Quantity: 1; REACH SVHC: No SVHC; Lead Free: Lead Free; Case Code (Metric): 1608; Min Operating Temperature: -55°C; Packaging: Tape and Reel; Tolerance: 10%; Voltage Rating: 50V; Case Code (Imperial): 0603; Capacitance: 100nF; Case/Package: 0603; Voltage Rating (DC): 50V; Depth: 0.8mm; Radiation Hardening: No; Ratings: AEC-Q200; Mount: Surface Mount; Voltage: 50V; Thickness: 0.035inch; Width: 0.8mm; Height: 0.8mm
Cout1-Cout4 = CMP-06035-007919-1: Chip Multilayer Ceramic Capacitors for General Purpose, 1206, 47uF, X5R, 15%, 10%, 10V; Width: 0.063inch; Thickness: 0.071inch; Max Operating Temperature: 85°C; Min Operating Temperature: -55°C; Length: 3.2mm; Case Code (Metric): 3216; Resistor Type: Ceramic; Packaging: Tape and Reel; Weight: 0.001411oz; Case Code (Imperial): 1206; Mount: Surface Mount; Depth: 1.6mm; Capacitance: 47uF; Package Quantity: 6000; Height: 1.6mm; Case/Package: 1206; Tolerance: 10%; Dielectric: X5R; Voltage Rating: 10V; Voltage Rating (DC): 10V; Termination: SMD/SMT
Cvcc = CMP-14477-000018-3: None; Voltage Rating (DC): 16V; Dielectric: X7R; Capacitance: 1uF; Tolerance: 10%; Halogen Free: Halogen Free; Height: 0.8mm; REACH SVHC: No SVHC; Contact Plating: Nickel; Number of Pins: 2; Resistor Type: Ceramic; Series: M; Thickness: 0.035inch; Construction: Flat; Voltage Rating: 16V; Packaging: Tape and Reel; Width: 0.031inch; Length: 1.6mm; Case Code (Metric): 1608; RoHS Compliant: Yes; Termination: SMD/SMT; Min Operating Temperature: -55°C; Case/Package: 0603; Mount: Surface Mount; Case Code (Imperial): 0603; Depth: 0.8mm; Package Quantity: 1; Max Operating Temperature: 125°C; Lead Free: Lead Free; Radiation Hardening: No
D1 = 0805 LED Red: LED; PartNumber: FC-2012HRK-620D; Manufacturer: Foshan NationStar Optoelectronics; ComponentLink1Description: 供应商链接; ComponentLink1URL: http://www.szlcsc.com/product/details_2668.html; Package: 0805; Supplier: LC; SuppliersPartNumber: C84256; Color: Red
D2 = 0805 LED Yellow: LED; PartNumber: 17-21SUYC/TR8; ComponentLink1Description: 供应商链接; ComponentLink1URL: http://www.szlcsc.com/product/details_2669.html; Package: 0805; Supplier: LC; SuppliersPartNumber: C2296; Color: Yellow
D3 = 0805 LED Green: LED; ComponentLink1Description: 供应商链接; ComponentLink1URL: http://www.szlcsc.com/product/details_2670.html; Package: 0805; Supplier: LC; SuppliersPartNumber: C2297; Color: Green
D4 = CMP-2000-04993-2: DIODE GEN PURP 100V 150MA SOD123; Max Reverse Leakage Current: 5uA; Max Surge Current: 2A; Reverse Recovery Time: 4ns; Polarity: Standard; Capacitance: 4pF; Max Forward Surge Current (Ifsm): 1A; Element Configuration: Single; Power Dissipation: 400mW; Forward Voltage: 1V; Radiation Hardening: No; Lead Free: Lead Free; Max Reverse Voltage (DC): 100V; Current Rating: 150mA; Forward Current: 150mA; Packaging: Tape and Reel; Number of Pins: 2; Package Quantity: 3000; Max Operating Temperature: 150°C; Min Operating Temperature: -65°C; Average Rectified Current: 150mA; Recovery Time: 4ns; Output Current: 150mA; Peak Non-Repetitive Surge Current: 2A; Width: 1.8mm; Voltage Rating (DC): 100V; Height: 1.2mm; Max Repetitive Reverse Voltage (Vrrm): 100V; Mount: Surface Mount; Length: 2.85mm
L1 = CMP-11268-000116-1: Surface Mount Power Inductor, 1.8 H, 21 A, 25 A, Shielded, 4460 ohm; RMS Current (Irms): 21A; Self Resonant Frequency: 43MHz; Inductance Tolerance: 20%; Inductance: 1.8uH; DC Resistance (DCR): 4.46mR; Test Frequency: 100kHz; Core Material: Composite; Saturation Current: 25A; Length: 8mm; Lead Free: Contains Lead; Height: 7mm; REACH SVHC: No SVHC; Max Operating Temperature: 125°C; Width: 7.7mm; Termination: SMD/SMT; Mount: Surface Mount; Packaging: Tape and Reel; Shielding: Shielded; Case/Package: SMD/SMT; RoHS Compliant: Yes; Package Quantity: 150; Tolerance: 20%; Min Operating Temperature: -40°C; Series: XAL7070; Max DC Current: 21A
R1 = 0603 1K (1001) 1%: Chip resistor; Manufacturer: Uniroyal Elec; PartNumber: 0603WAF1001T5E; Power: 1/10W; ComponentLink1Description: Supplier link; ComponentLink1URL: http://www.szlcsc.com/product/details_21904.html; Package: 0603; Supplier: LC; SuppliersPartNumber: C21190; Resistance: 1KΩ; Tolerance: 1%
R2 = 0603 510R (5100) 1%: Chip resistor; Manufacturer: Uniroyal Elec; PartNumber: 0603WAF5100T5E; Power: 1/10W; ComponentLink1Description: Supplier link; ComponentLink1URL: http://www.szlcsc.com/product/details_23920.html; Package: 0603; Supplier: LC; SuppliersPartNumber: C23193; Resistance: 510Ω; Tolerance: 1%
R3 = 0603 220R (2200) 1%: Chip resistor; Manufacturer: Uniroyal Elec; PartNumber: 0603WAF2200T5E; Power: 1/10W; ComponentLink1Description: Supplier link; ComponentLink1URL: http://www.szlcsc.com/product/details_23689.html; Package: 0603; Supplier: LC; SuppliersPartNumber: C22962; Resistance: 220Ω; Tolerance: 1%
Renb = CMP-2002-00080-2: RES Thick Film, 51.1kΩ, 1%, 0.063W, 100ppm/°C, 0402; Voltage Rating (DC): 50V; Max Power Dissipation: 63mW; Resistance: 51.1kR; Case Code (Imperial): 0402; Tolerance: 1%; Width: 0.5mm; Case Code (Metric): 1005; Termination: SMD/SMT; Features: Automotive AEC-Q200; Composition: Thick Film; Package Quantity: 10; Max Operating Temperature: 155°C; Number of Pins: 2; Weight: 2.3E-05oz; Temperature Coefficient: 100ppm/°C; Radiation Hardening: No; Case/Package: 0402; Length: 1mm; Contact Plating: Tin; Depth: 0.5mm; Height: 0.35mm; Packaging: Tape and Reel; Military Standard: Not; Mount: Surface Mount; Min Operating Temperature: -55°C; Number of Terminations: 2; Power Rating: 63mW; Lead Free: Lead Free; Voltage Rating: 50V
Rent = CMP-2002-08374-1: Manufacturer: Vishay Dale; Part Number: CRCW0402221KFKED
Rfbb Rml = CMP-2002-08219-2: RES Thick Film, 15kΩ, 1%, 0.063W, 100ppm/°C, 0402; Voltage Rating: 50V; Power Rating: 63mW; Resistance: 15kR; Weight: 2.3E-05oz; Length: 1mm; Temperature Coefficient: 100ppm/°C; Min Operating Temperature: -55°C; Mount: Surface Mount; Termination: SMD/SMT; Working Voltage: 50V; Voltage Rating (DC): 50V; Width: 0.02inch; Case Code (Metric): 1005; Max Operating Temperature: 155°C; Contact Plating: Tin; Case/Package: 0402; Composition: Thick Film; Tolerance: 1%; Number of Terminations: 2; Height: 0.35mm; Case Code (Imperial): 0402; Max Power Dissipation: 63mW; Features: Automotive AEC-Q200; Depth: 0.5mm; Military Standard: Not; Radiation Hardening: No; Packaging: Tape and Reel; Package Quantity: 10; Lead Free: Lead Free
Rfbt = CMP-2002-08148-1: Manufacturer: Vishay Dale; Part Number: CRCW0402110KFKED
Rmh = CMP-1012-00793-1: 330K 0.1W 1% 0603 (1608 Metric)  SMD; Case-EIA: 0603; Case-Metric: 1608; Value: 330000.00 Ohm; Power: 0.1 W; Technology: SMT; Tolerance: 1 %
Rpg = CMP-02407-010951-1: RES 100K OHM 1% 1/16W 0402; Temperature Coefficient: 100ppm/°C; Power Rating: 62.5mW; Resistance: 100kR; Lead Free: Lead Free; Length: 1mm; Tolerance: 1%; Resistor Type: Thick Film; Contact Plating: Tin; Case/Package: SMD/SMT; Min Operating Temperature: -55°C; RoHS Compliant: Yes; Termination: Wraparound; Max Operating Temperature: 155°C; Mount: Surface Mount
U1 = CMP-04918-000702-1: 10-A SYNCHRONOUS STEP-DOWN REGUL
U2 = CMP-12756-000035-1: IC REG LINEAR 3.3V 600MA SOT25; Number of Regulators: 1; Output Type: Fixed; Polarity: Positive; Min Input Voltage: 2.5V; Max Input Voltage: 6V; Accuracy: 1.5%; Quiescent Current: 55uA; Dropout Voltage: 250mV; Min Operating Temperature: -40°C; Length: 3.1mm; Output Current: 600mA; Max Operating Temperature: 85°C; Package Quantity: 1; Output Voltage: 3.3V; Width: 1.7mm; Number of Outputs: 1; Packaging: Tape and Reel; Height: 1.3mm; Lead Free: Lead Free; Max Output Current: 600mA; Case/Package: SOT-23-5; Mount: Surface Mount; Number of Pins: 5

## Nets that join several sheets
GND: MCU (20 pins), CAN (C18.2 R9.1 U3.2), Connectors (11 pins), Power (24 pins)
VCC3V3: MCU (15 pins), CAN (C18.1 U3.3), Connectors (9 pins), Power (C4.2 R3.2 U2.5)
VCC5V: Connectors (J2.1 J12.6), Power (10 pins)
VCC12V: Connectors (J1.1), Power (9 pins)
BUTTON1: MCU (IC1.37), Connectors (J4.1 R4.1)
BUTTON2: MCU (IC1.25), Connectors (J5.1 R5.1)
BUTTON3: MCU (IC1.36), Connectors (J6.1 R6.1)
BUTTON4: MCU (IC1.24), Connectors (J7.1 R7.1)
CAN1_N: CAN (U3.6), Connectors (J8.2)
CAN1_P: CAN (U3.7), Connectors (J8.1)
NetIC1_16: MCU (IC1.16), Connectors (J11.5)
NetIC1_17: MCU (IC1.17), Connectors (J11.4)
NetIC1_20: MCU (IC1.20), Connectors (J12.4)
NetIC1_21: MCU (IC1.21), Connectors (J12.3)
NetIC1_22: MCU (IC1.22), Connectors (J12.2)
NetIC1_23: MCU (IC1.23), Connectors (J12.1)
NetIC1_44: MCU (IC1.44), CAN (U3.4)
NetIC1_45: MCU (IC1.45), CAN (U3.1)
NetIC1_46: MCU (IC1.46), Connectors (J11.2)
NetIC1_49: MCU (IC1.49), Connectors (J11.3)
RPOT1: MCU (IC1.26), Connectors (J9.2)
RPOT2: MCU (IC1.27), Connectors (J10.2)